# Altium project PCB_Project_1.PrjPcb
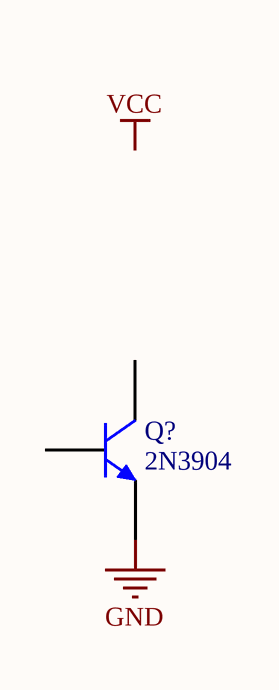
[diagram p0: Sheet2.SchDoc]
1 sheet, 1 parts. Net scope: global (net labels, ports and power ports of the same name join across sheets).

## Sheet Sheet2.SchDoc
size A

### Parts
Q?  2N3904  [TO-92A]

### Nets
GND: Q?.1(E)

Not connected (* = marked no-connect by the designer): Q? 2(B) 3(C)

### Notes on the sheet
- Labels drawn without touching a wire or pin: VCC

### Library data of the parts
Q? = 2N3904: NPN General Purpose Amplifier; Published: 8-Jun-2000; LatestRevisionDate: 15-Jan-2003; LatestRevisionNote: PCB Footprint 'BCY-W3/D4.7' replaced; DatasheetVersion: 1997; PackageVersion: Sep-1998; PackageReference: TO-92A; Publisher: Altium Limited; PackageDescription: TO, Flat Index; 3 In-Line, Axial Leads; Body Dia. 4.5mm; Leads 0.51 x 0.48 mm (max); ComponentLink1Description: Manufacturer Link; ComponentLink1URL: http://www.fairchildsemi.com/; ComponentLink2Description: Datasheet; ComponentLink2URL: http://www.fairchildsemi.com/ds/2N%2F2N3904.pdf